# Altium schematic sheet eGAN-FET-module_Connectors.SchDoc
size 420 x 297 mm; SheetNumber: 5; Format: A3
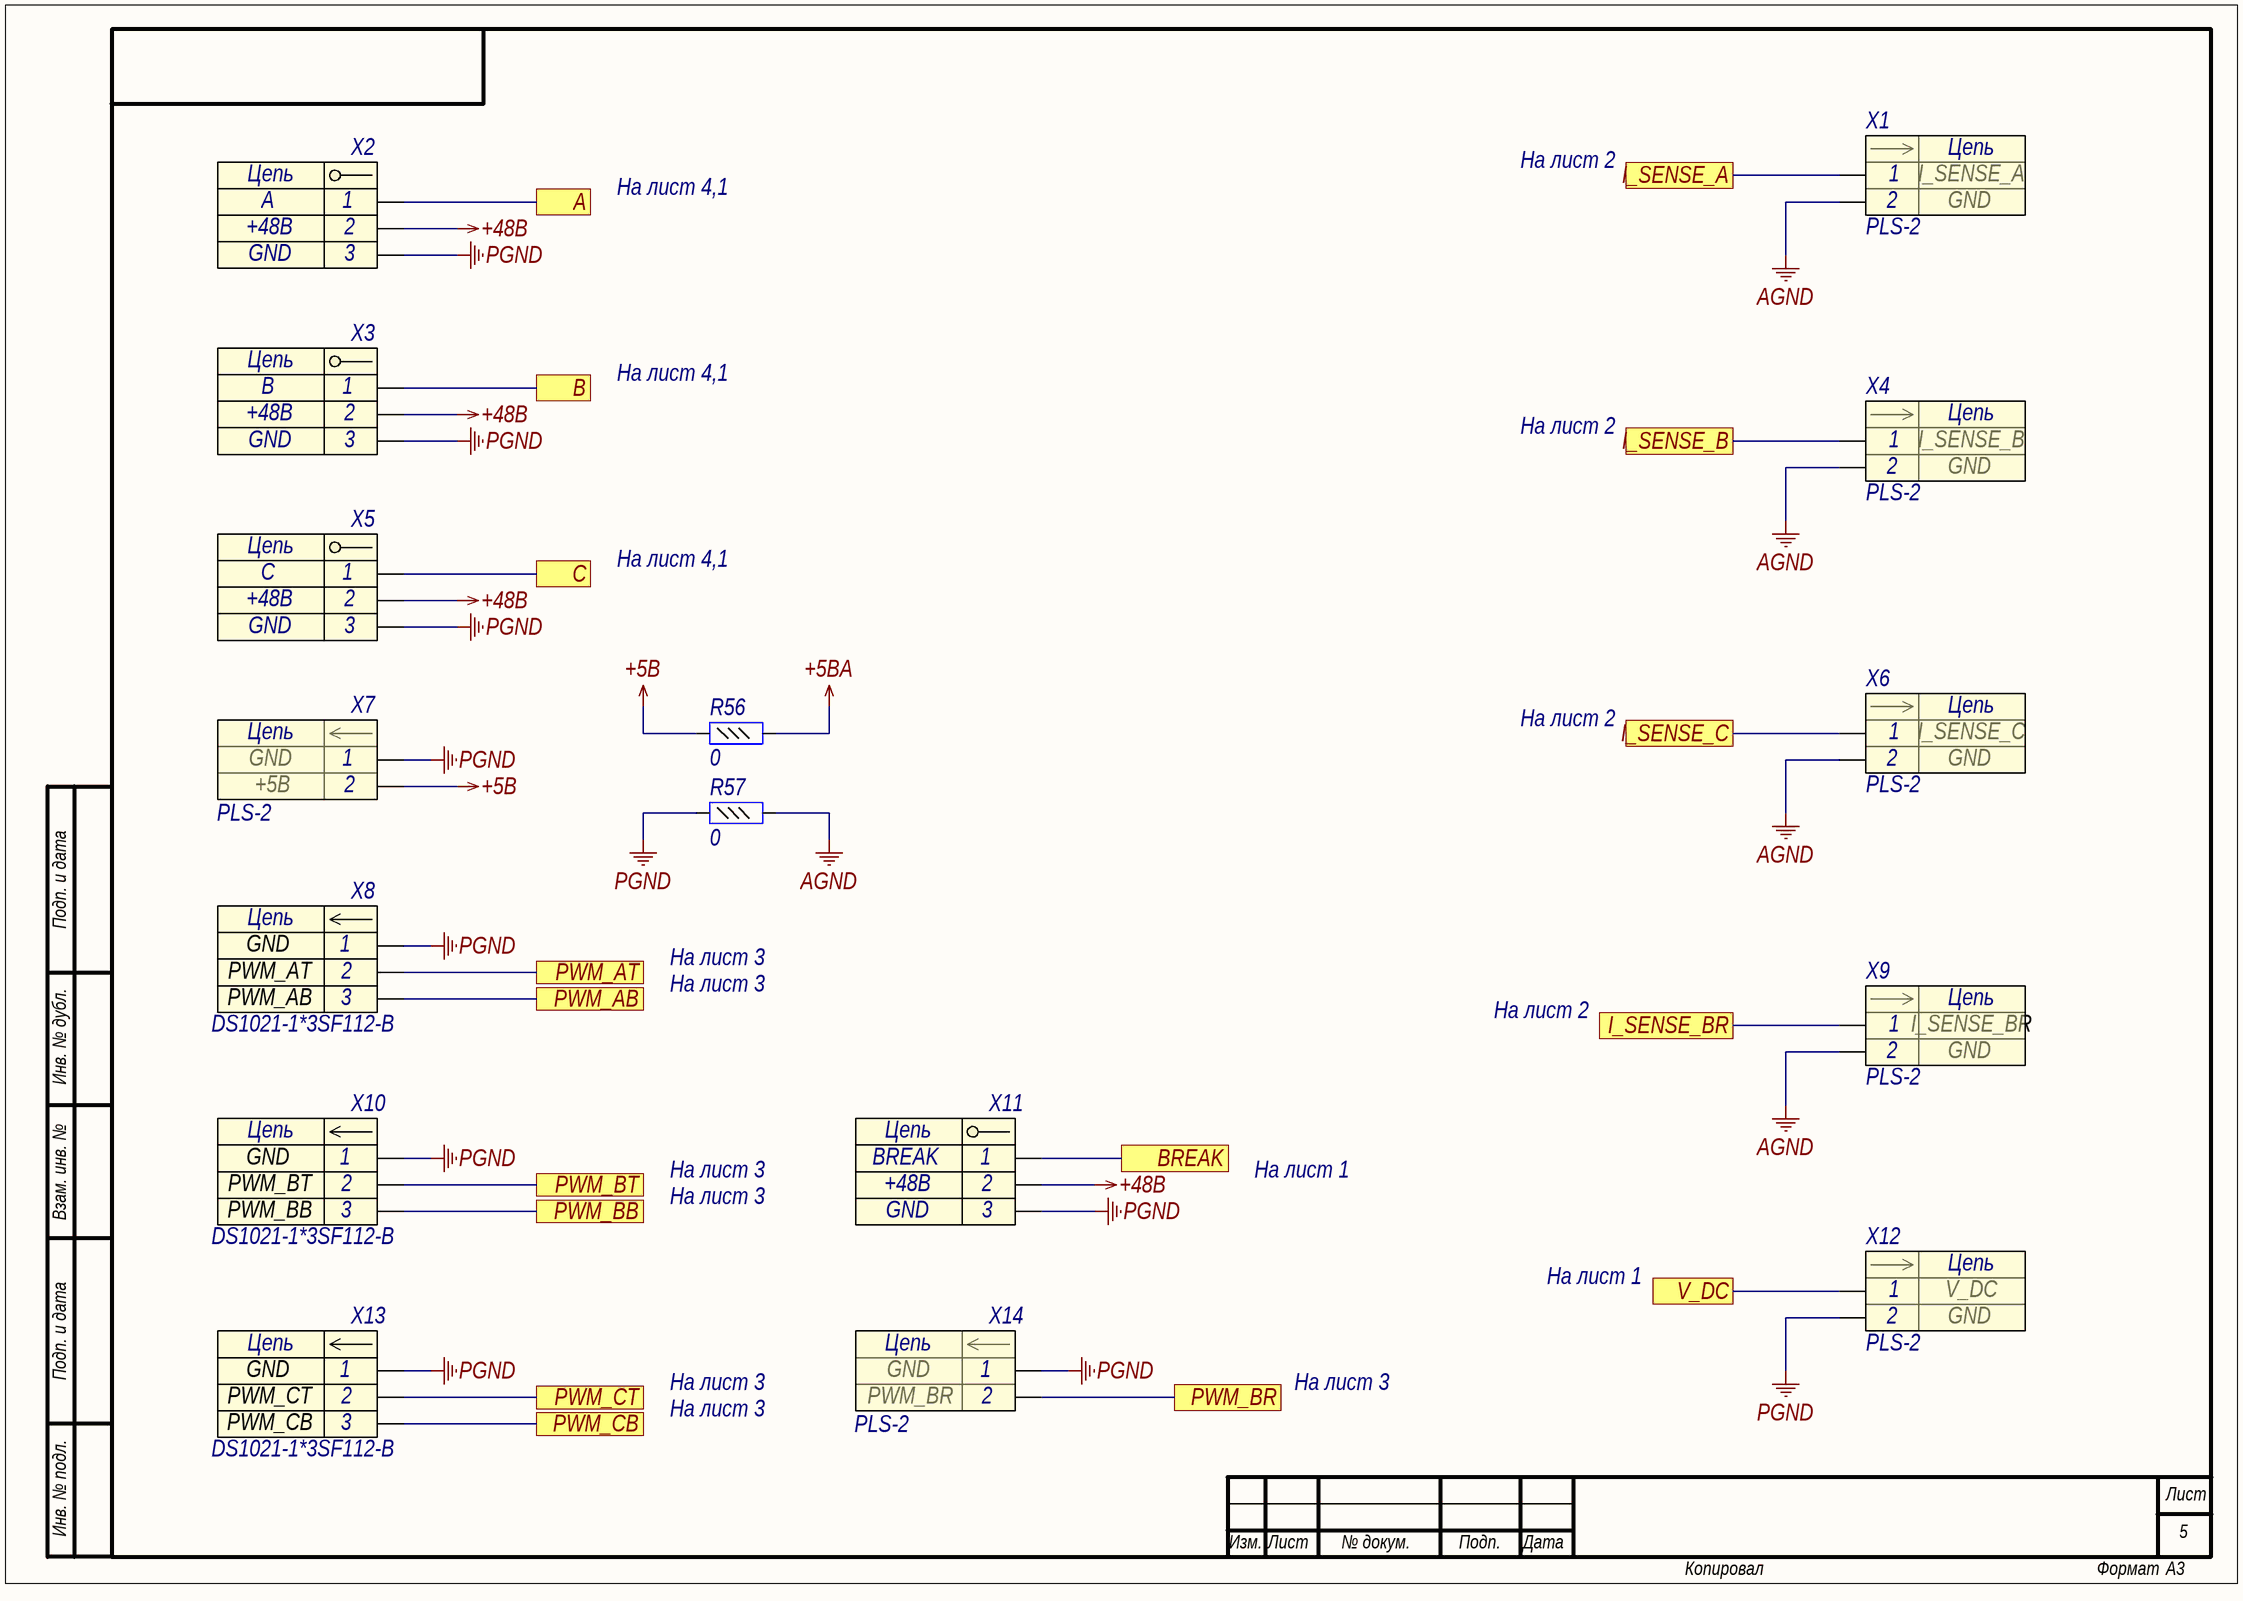
[diagram p0: eGAN-FET-module_Connectors.SchDoc]

## Parts
R56  0  [R0402]
R57  0  [R0402]
X1  (no value)  [PLS-2]
X2  (no value)  [KUBO_3]
X3  (no value)  [KUBO_3]
X4  (no value)  [PLS-2]
X5  (no value)  [KUBO_3]
X6  (no value)  [PLS-2]
X7  (no value)  [PLS-2]
X8  DS1021-1*3SF112-B  [PLS-3]
X9  (no value)  [PLS-2]
X10  DS1021-1*3SF112-B  [PLS-3]
X11  (no value)  [KUBO_3]
X12  (no value)  [PLS-2]
X13  DS1021-1*3SF112-B  [PLS-3]
X14  (no value)  [PLS-2]

## Ports
A, B, BREAK, C, I_SENSE_A, I_SENSE_B, I_SENSE_BR, I_SENSE_C, PWM_AB, PWM_AT, PWM_BB, PWM_BR, PWM_BT, PWM_CB, PWM_CT, V_DC

## Nets
+5B: R56.1 X7.2
+5BA: R56.2
+48B: X2.2 X3.2 X5.2 X11.2
AGND: R57.2 X1.2 X4.2 X6.2 X9.2
PGND: R57.1 X2.3 X3.3 X5.3 X7.1 X8.1 X10.1 X11.3 X12.2 X13.1 X14.1
A: X2.1 ; port A
B: X3.1 ; port B
BREAK: X11.1 ; port BREAK
C: X5.1 ; port C
I_SENSE_A: X1.1 ; port I_SENSE_A
I_SENSE_B: X4.1 ; port I_SENSE_B
I_SENSE_BR: X9.1 ; port I_SENSE_BR
I_SENSE_C: X6.1 ; port I_SENSE_C
PWM_AB: X8.3 ; port PWM_AB
PWM_AT: X8.2 ; port PWM_AT
PWM_BB: X10.3 ; port PWM_BB
PWM_BR: X14.2 ; port PWM_BR
PWM_BT: X10.2 ; port PWM_BT
PWM_CB: X13.3 ; port PWM_CB
PWM_CT: X13.2 ; port PWM_CT
V_DC: X12.1 ; port V_DC

## Notes on the sheet
- На лист 2
- На лист 4,1
- Подп. и дата
- На лист 3
- Инв. № дубл.
- Взам. инв. №
- На лист 1
- Инв. № подл.
- Лист
- Изм.
- № докум.
- Подп.
- Дата
- Копировал
- Формат
- (in symbol connect33) Цепь
- (in symbol connect159) Цепь
- (in symbol connect234) Цепь

## Library data of the parts
R56 R57 = res197: Резистор; Part Name: Resistor; Manufacture: Yageo; Part Number: RC0402FR-070RL; id: res197; Accuracy: 0.01; Power: 0,062Вт; Value: 0
X1 = connect159: Разъем - 2 конт. вилка; Contact_1: I_SENSE_A; Contact_2: GND; Etch: 2,54mm; Part Name: PLS-2; id: connect159
X2 = connect234: Разъем - 3 конт. клеммник; Part Name: 3 отверстия под запайку; Contact_1: A; Contact_2: +48B; Contact_3: GND; id: connect234
X3 = connect234: Разъем - 3 конт. клеммник; Part Name: 3 отверстия под запайку; Contact_1: B; Contact_2: +48B; Contact_3: GND; id: connect234
X4 = connect159: Разъем - 2 конт. вилка; Contact_1: I_SENSE_B; Contact_2: GND; Etch: 2,54mm; Part Name: PLS-2; id: connect159
X5 = connect234: Разъем - 3 конт. клеммник; Part Name: 3 отверстия под запайку; Contact_1: C; Contact_2: +48B; Contact_3: GND; id: connect234
X6 = connect159: Разъем - 2 конт. вилка; Contact_1: I_SENSE_C; Contact_2: GND; Etch: 2,54mm; Part Name: PLS-2; id: connect159
X7 = connect159: Разъем - 2 конт. вилка; Contact_1: GND; Contact_2: +5B; Etch: 2,54mm; Part Name: PLS-2; id: connect159
X8 = connect33: Разъем - 3 конт. вилка; Manufacture: Ningbo connfly electronic; Contact_1: GND; Contact_2: PWM_AT; Contact_3: PWM_AB; Etch: 2,54mm; Part Name: PLS-3; id: connect33; Part Number: DS1021-1*3SF112-B
X9 = connect159: Разъем - 2 конт. вилка; Contact_1: I_SENSE_BR; Contact_2: GND; Etch: 2,54mm; Part Name: PLS-2; id: connect159
X10 = connect33: Разъем - 3 конт. вилка; Manufacture: Ningbo connfly electronic; Contact_1: GND; Contact_2: PWM_BT; Contact_3: PWM_BB; Etch: 2,54mm; Part Name: PLS-3; id: connect33; Part Number: DS1021-1*3SF112-B
X11 = connect234: Разъем - 3 конт. клеммник; Part Name: 3 отверстия под запайку; Contact_1: BREAK; Contact_2: +48B; Contact_3: GND; id: connect234
X12 = connect159: Разъем - 2 конт. вилка; Contact_1: V_DC; Contact_2: GND; Etch: 2,54mm; Part Name: PLS-2; id: connect159
X13 = connect33: Разъем - 3 конт. вилка; Manufacture: Ningbo connfly electronic; Contact_1: GND; Contact_2: PWM_CT; Contact_3: PWM_CB; Etch: 2,54mm; Part Name: PLS-3; id: connect33; Part Number: DS1021-1*3SF112-B
X14 = connect159: Разъем - 2 конт. вилка; Contact_1: GND; Contact_2: PWM_BR; Etch: 2,54mm; Part Name: PLS-2; id: connect159